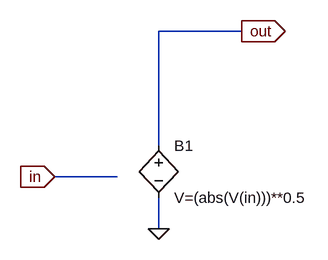
[diagram p0: schematic Square_root.asc]
Square_root.asc, the LTspice schematic file:
Version 4
SHEET 1 1216 680
WIRE 496 -64 368 -64
WIRE 368 112 368 -64
WIRE 304 160 208 160
WIRE 368 240 368 192
FLAG 208 160 in
IOPIN 208 160 In
FLAG 496 -64 out
IOPIN 496 -64 Out
FLAG 368 240 0
SYMBOL bv 368 96 R0
SYMATTR InstName B1
SYMATTR Value V=(abs(V(in)))**0.5

The netlist it stands for:
* Square_root.asc
B1 out 0 V=(abs(V(in)))**0.5
.backanno
.end